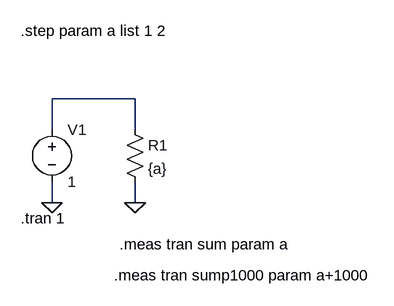
[diagram p0: schematic test5.asc]
test5.asc, the LTspice schematic file:
Version 4
SHEET 1 880 680
WIRE 208 96 80 96
WIRE 80 144 80 96
WIRE 208 144 208 96
WIRE 80 256 80 224
WIRE 208 256 208 224
FLAG 80 256 0
FLAG 208 256 0
SYMBOL voltage 80 128 R0
SYMATTR InstName V1
SYMATTR Value 1
SYMBOL res 192 128 R0
SYMATTR InstName R1
SYMATTR Value {a}
TEXT 32 -8 Left 2 !.step param a list 1 2
TEXT 32 280 Left 2 !.tran 1
TEXT 184 320 Left 2 !.meas tran sum param a
TEXT 176 368 Left 2 !.meas tran sump1000 param a+1000

The netlist it stands for:
* test5.asc
V1 N001 0 1
R1 N001 0 {a}
.step param a list 1 2
.tran 1
.meas tran sum param a
.meas tran sump1000 param a+1000
.backanno
.end